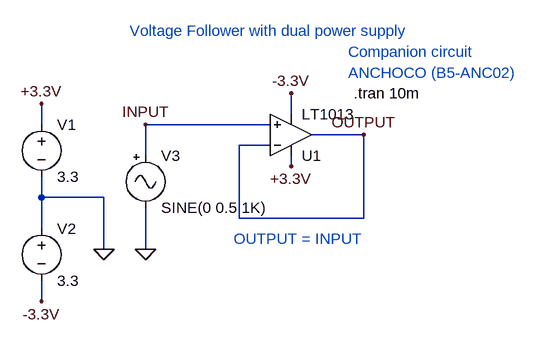
[diagram p0: schematic voltage_follower_dual_pow.asc]
voltage_follower_dual_pow.asc, the LTspice schematic file:
Version 4
SHEET 1 948 680
WIRE -48 32 -48 0
WIRE -432 48 -432 16
WIRE -80 48 -272 48
WIRE 64 64 -16 64
WIRE -80 80 -128 80
WIRE -272 96 -272 48
WIRE -48 112 -48 96
WIRE -432 160 -432 128
WIRE -336 160 -432 160
WIRE -128 192 -128 80
WIRE 64 192 64 64
WIRE 64 192 -128 192
WIRE -432 208 -432 160
WIRE -336 240 -336 160
WIRE -272 240 -272 176
WIRE -432 320 -432 288
FLAG -336 240 0
FLAG -432 16 +3.3V
FLAG -432 320 -3.3V
FLAG -48 112 +3.3V
FLAG -48 0 -3.3V
FLAG -272 240 0
FLAG -272 48 INPUT
FLAG 64 64 OUTPUT
SYMBOL voltage -432 32 R0
WINDOW 123 0 0 Left 0
WINDOW 39 0 0 Left 0
SYMATTR InstName V1
SYMATTR Value 3.3
SYMBOL voltage -432 192 R0
WINDOW 123 0 0 Left 0
WINDOW 39 0 0 Left 0
SYMATTR InstName V2
SYMATTR Value 3.3
SYMBOL Misc\\signal -272 80 R0
WINDOW 123 0 0 Left 0
WINDOW 39 0 0 Left 0
SYMATTR InstName V3
SYMATTR Value SINE(0 0.5 1K)
SYMBOL Opamps\\LT1013 -48 128 M180
SYMATTR InstName U1
TEXT 48 0 Left 2 !.tran 10m
TEXT -296 -96 Left 2 ;Voltage Follower with dual power supply
TEXT 40 -32 Left 2 ;ANCHOCO (B5-ANC02)
TEXT 40 -64 Left 2 ;Companion circuit
TEXT -136 224 Left 2 ;OUTPUT = INPUT

The netlist it stands for:
* voltage_follower_dual_pow.asc
V1 +3.3V 0 3.3
V2 0 -3.3V 3.3
V3 INPUT 0 SINE(0 0.5 1K)
XU1 INPUT OUTPUT +3.3V -3.3V OUTPUT LT1013  ; pins In+ In- V+ V- OUT
.tran 10m
* Voltage Follower with dual power supply
* ANCHOCO (B5-ANC02)
* Companion circuit
* OUTPUT = INPUT
.lib LTC.lib
.backanno
.end